# Altium schematic sheet 6_Power distribution II.schdoc
size 497 x 243 mm; Name: A_A4; Symbol: A_A4; Device: A_A4; @Project Name: TUD-EnergyHarvestingConsole_2022-08-29_17-01-09; REV: 1.0; Date: 2022-07-06; Sheet: 1/1; Draw By: Alejandro Cabrerizo; Convert to PCB: yes; Add into BOM: yes
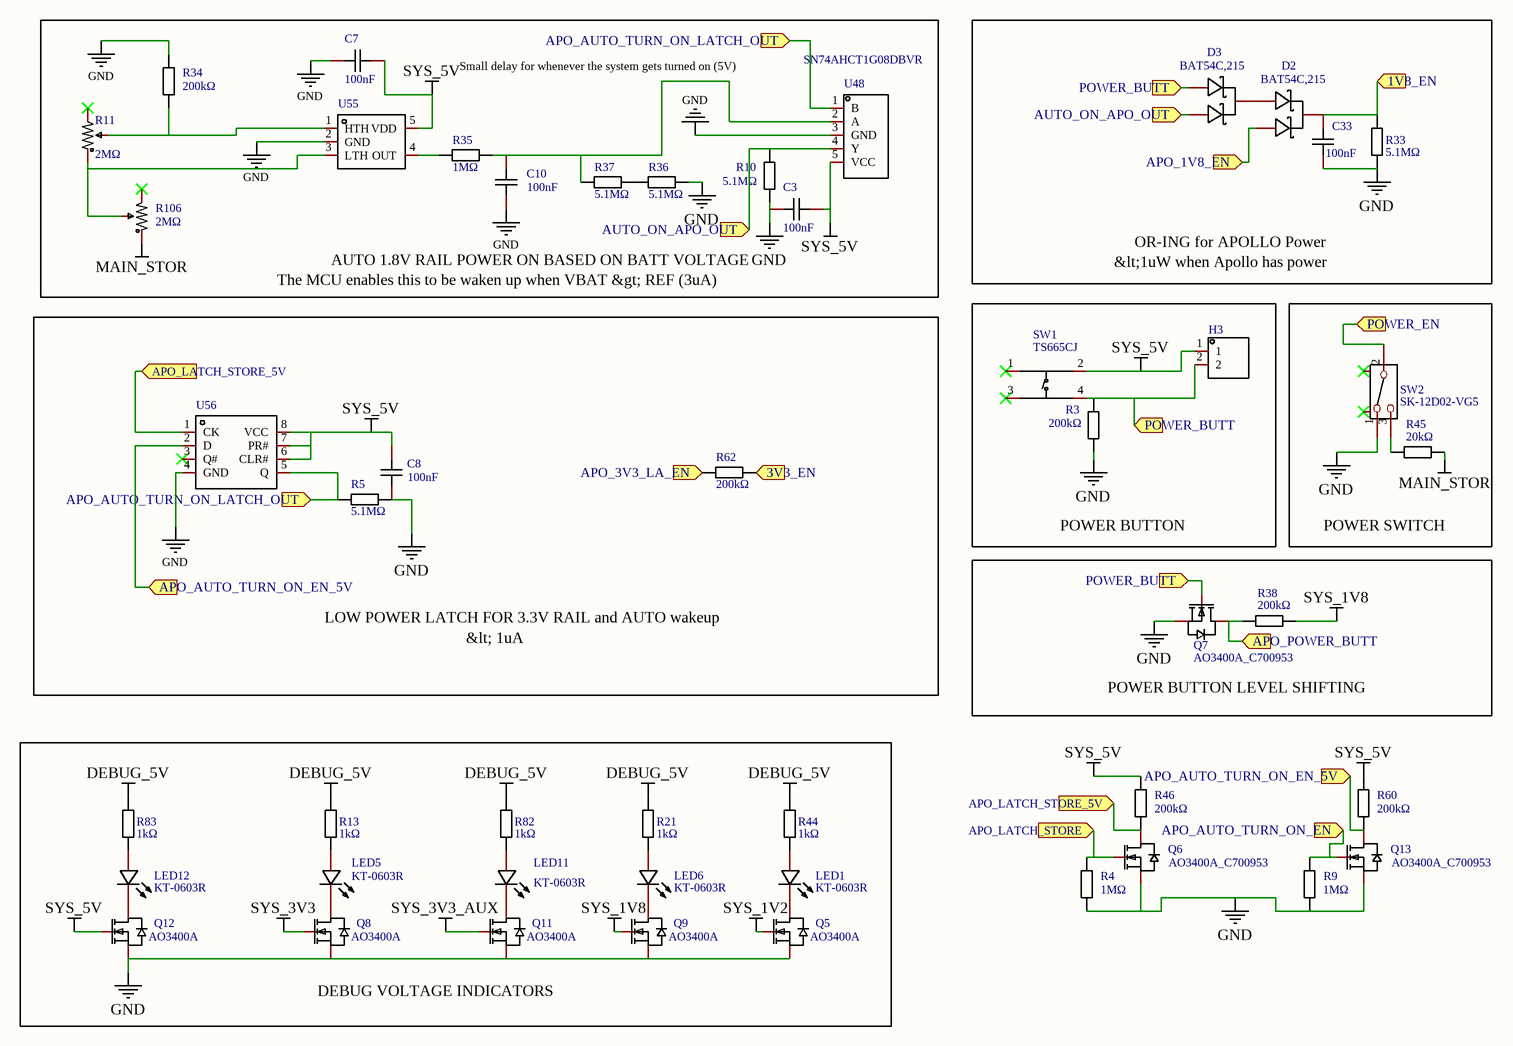
[diagram p0: 6_Power distribution II.schdoc]

## Parts
C3  100nF  [C0603]
C7  100nF  [C0603]
C8  100nF  [C0603]
C10  100nF  [C0603]
C33  100nF  [C0603]
D2  BAT54C,215  [SOT-23-3_L2.9-W1.6-P1.90-LS2.8-BR]
D3  BAT54C,215  [SOT-23-3_L2.9-W1.6-P1.90-LS2.8-BR]
H3  HDR-M_2.54_1x2P  [HDR-TH_2P-P2.54-V-M-1]  (value not drawn)
LED1  KT-0603R  [LED0603-R-RD]
LED5  KT-0603R  [LED0603-R-RD]
LED6  KT-0603R  [LED0603-R-RD]
LED11  KT-0603R  [LED0603-R-RD]
LED12  KT-0603R  [LED0603-R-RD]
Q5  AO3400A  [SOT-23-3_L2.9-W1.3-P1.90-LS2.4-BR]
Q6  AO3400A_C700953  [SOT-23-3_L2.9-W1.3-P1.90-LS2.4-BR]
Q7  AO3400A_C700953  [SOT-23-3_L2.9-W1.3-P1.90-LS2.4-BR]
Q8  AO3400A  [SOT-23-3_L2.9-W1.3-P1.90-LS2.4-BR]
Q9  AO3400A  [SOT-23-3_L2.9-W1.3-P1.90-LS2.4-BR]
Q11  AO3400A  [SOT-23-3_L2.9-W1.3-P1.90-LS2.4-BR]
Q12  AO3400A  [SOT-23-3_L2.9-W1.3-P1.90-LS2.4-BR]
Q13  AO3400A_C700953  [SOT-23-3_L2.9-W1.3-P1.90-LS2.4-BR]
R3  200kΩ  [R0603]
R4  1MΩ  [R0603]
R5  5.1MΩ  [R0603]
R9  1MΩ  [R0603]
R10  5.1MΩ  [R0603]
R11  2MΩ  [RES-ADJ-TH_3P-L9.5-W9.5-P2.54-BR-BS]
R13  1kΩ  [R0603]
R21  1kΩ  [R0603]
R33  5.1MΩ  [R0603]
R34  200kΩ  [R0603]
R35  1MΩ  [R0603]
R36  5.1MΩ  [R0603]
R37  5.1MΩ  [R0603]
R38  200kΩ  [R0603]
R44  1kΩ  [R0603]
R45  20kΩ  [R0603]
R46  200kΩ  [R0603]
R60  200kΩ  [R0603]
R62  200kΩ  [R0603]
R82  1kΩ  [R0603]
R83  1kΩ  [R0603]
R106  2MΩ  [RES-ADJ-TH_3P-L9.5-W9.5-P2.54-BR-BS]
SW1  TS665CJ  [SW-TH_4P-L6.0-W6.0-P4.50-LS6.5]
SW2  SK-12D02-VG5  [SW-TH_SK-12D02-VG5]
U48  Manufacturer Part: SN74AHCT1G08DBVR  [SOT-23-5_L3.0-W1.7-P0.95-LS2.8-BR]  (hidden comment: SN74AHCT1G08DBVR_C113521)
U55  MIC841HYC5-TR  [SC-70-5_L2.1-W1.3-P0.65-LS2.1-BL]  (value not drawn)
U56  TC7W74FU,LF  [TSSOP-8_L3.0-W3.0-P0.65-LS4.9-BR]  (value not drawn)

## Blocks framed on the sheet
POWER BUTTON: H3 R3 SW1
POWER SWITCH: R45 SW2
POWER BUTTON LEVEL SHIFTING: Q7 R38
DEBUG VOLTAGE INDICATORS: LED1 LED5 LED6 LED11 LED12 Q5 Q8 Q9 Q11 Q12 R13 R21 R44 R82 R83

## Ports
1V8_EN (in), 3V3_EN (in), APO_1V8_EN (in), APO_3V3_LA_EN (in), APO_AUTO_TURN_ON_EN (in), APO_AUTO_TURN_ON_EN_5V (in), APO_AUTO_TURN_ON_LATCH_OUT (in), APO_LATCH_STORE (in), APO_LATCH_STORE_5V (in), APO_POWER_BUTT (in), AUTO_ON_APO_OUT (in), POWER_BUTT (in), POWER_EN (in)

## Nets
DEBUG_5V: R13.2 R21.2 R44.2 R82.2 R83.2
GND: C3.1 C7.1 C8.2 C10.1 C33.2 Q5.2(S) Q6.2(S) Q7.2(S) Q8.2(S) Q9.2(S) Q11.2(S) Q12.2(S) Q13.2(S) R3.1 R4.2 R5.2 R9.2 R10.2 R33.2 R34.1 R36.2 SW2.1 U48.3(GND) U55.2(GND) U56.4(GND)
MAIN_STOR: R45.1 R106.1
SYS_1V2: Q5.1(G)
SYS_1V8: Q9.1(G) R38.1
SYS_3V3: Q8.1(G)
SYS_3V3_AUX: Q11.1(G)
SYS_5V: C3.2 C7.2 C8.1 H3.1 Q12.1(G) R46.1 R60.1 SW1.2(B) U48.5(VCC) U55.5(VDD) U56.6(CLR#) U56.7(PR#) U56.8(VCC)
1V8_EN: C33.1 D2.3(K) R33.1 ; port 1V8_EN
3V3_EN: R62.2 ; port 3V3_EN
APO_1V8_EN: D2.2(A) ; port APO_1V8_EN
APO_3V3_LA_EN: R62.1 ; port APO_3V3_LA_EN
APO_AUTO_TURN_ON_EN: Q13.1(G) R9.1 ; port APO_AUTO_TURN_ON_EN
APO_AUTO_TURN_ON_EN_5V: Q13.3(D) R60.2 U56.2(D) ; port APO_AUTO_TURN_ON_EN_5V
APO_AUTO_TURN_ON_LATCH_OUT: R5.1 U48.1(B) U56.5(Q) ; port APO_AUTO_TURN_ON_LATCH_OUT
APO_LATCH_STORE: Q6.1(G) R4.1 ; port APO_LATCH_STORE
APO_LATCH_STORE_5V: Q6.3(D) R46.2 U56.1(CK) ; port APO_LATCH_STORE_5V
APO_POWER_BUTT: Q7.3(D) R38.2 ; port APO_POWER_BUTT
AUTO_ON_APO_OUT: D3.2(A) R10.1 U48.4(Y) ; port AUTO_ON_APO_OUT
POWER_BUTT: D3.1(A) H3.2 Q7.1(G) R3.2 SW1.4(D) ; port POWER_BUTT
POWER_EN: SW2.2 ; port POWER_EN
NetC10_2: C10.2 R35.1 R37.1 U48.2(A)
NetD2_1: D2.1(A) D3.3(K)
NetLED1_1: LED1.1(A) R44.1
NetLED1_2: LED1.2(K) Q5.3(D)
NetLED5_1: LED5.1(A) R13.1
NetLED5_2: LED5.2(K) Q8.3(D)
NetLED6_1: LED6.1(A) R21.1
NetLED6_2: LED6.2(K) Q9.3(D)
NetLED11_1: LED11.1(A) R82.1
NetLED11_2: LED11.2(K) Q11.3(D)
NetLED12_1: LED12.1(A) R83.1
NetLED12_2: LED12.2(K) Q12.3(D)
NetR11_1: R11.1 R106.2 U55.3(LTH)
NetR11_2: R11.2 R34.2 U55.1(HTH)
NetR35_2: R35.2 U55.4(OUT)
NetR36_1: R36.1 R37.2
NetR45_2: R45.2 SW2.3

Not connected (* = marked no-connect by the designer): R11 3*; R106 3*; SW1 1(A)* 3(C)*; SW2 4* 5*; U56 3(Q#)*

## Notes on the sheet
- Small delay for whenever the system gets turned on (5V)
- OR-ING for APOLLO Power
- The MCU enables this to be waken up when VBAT &gt; REF (3uA)
- AUTO 1.8V RAIL POWER ON BASED ON BATT VOLTAGE
- &lt;1uW when Apollo has power
- LOW POWER LATCH FOR 3.3V RAIL and AUTO wakeup
- &lt; 1uA
- 1
- 2
- 3
- 4
- 5
- A
- B
- C
- D
- TITLE:
- TUD-EnergyHarvestingConsole_2022-08-29_17-01-09
- REV:
- 1.0
- Date:
- Company:
- 2022-07-06
- Drawn By:
- Alejandro Cabrerizo
- Sheet:
- 1/1

## Library data of the parts
C3 C7 C8 C10 C33 = CC0603KRX7R9BB104: Manufacturer: YAGEO; Convert to PCB: yes; Name: 100nF; Symbol: 100nF; Device: CC0603KRX7R9BB104; Supplier: LCSC; Manufacturer Part: CC0603KRX7R9BB104; Supplier Part: C14663; JLCPCB Part Class: Basic; Add into BOM: yes; Origin Footprint: C0603
D2 D3 = BAT54C,215: Manufacturer: Nexperia; Convert to PCB: yes; Name: BAT54C,215; Symbol: BAT54C,215; Device: BAT54C,215; Supplier: LCSC; Manufacturer Part: BAT54C,215; Supplier Part: C37704; JLCPCB Part Class: Basic Part; Add into BOM: yes; Origin Footprint: SOT-23-3_L2.9-W1.6-P1.90-LS2.8-BR
H3 = HDR-M_2.54_1x2P: Symbol: 210S-1*2P L=11.6MMGold-plated black; Convert to PCB: yes; Device: HDR-M_2.54_1x2P; Add into BOM: yes; Supplier Footprint: Through
LED1 LED5 LED6 LED11 LED12 = KT-0603R: Manufacturer: KENTO; Convert to PCB: yes; Name: KT-0603R; Symbol: KT-0603R; Device: KT-0603R; Supplier: LCSC; Manufacturer Part: KT-0603R; Supplier Part: C2286; JLCPCB Part Class: Basic Part; Add into BOM: yes; Origin Footprint: LED0603-R-RD
Q5 Q9 Q11 = AO3400A: Manufacturer: HUASHUO(华朔); Convert to PCB: yes; NUMBER: 3; Name: AO3400A; Symbol: AO3400A; Device: AO3400A; Supplier: LCSC; Supplier Part: C700953; Manufacturer Part: AO3400A; JLCPCB Part Class: Extended Part; Add into BOM: yes; Origin Footprint: SOT-23-3_L2.9-W1.3-P1.90-LS2.4-BR
Q6-Q8 Q12 Q13 = AO3400A: Manufacturer: HUASHUO(华朔); Convert to PCB: yes; Symbol: AO3400A; Device: AO3400A; Supplier: LCSC; Supplier Part: C700953; Manufacturer Part: AO3400A; JLCPCB Part Class: Extended Part; Add into BOM: yes; Origin Footprint: SOT-23-3_L2.9-W1.3-P1.90-LS2.4-BR
  Q6 Q7 Q13: Name: AO3400A_C700953
  Q8 Q12: Name: AO3400A
R3 R34 R38 R46 R60 R62 = 0603WAF2003T5E: Manufacturer: UniOhm; Resistance: 200K; Convert to PCB: yes; Name: 200kΩ; Symbol: 200kΩ; Device: 0603WAF2003T5E; Supplier: LCSC; Manufacturer Part: 0603WAF2003T5E; Supplier Part: C25811; JLCPCB Part Class: Basic Part; Add into BOM: yes; Origin Footprint: R0603
R4 R9 = 0603WAF1004T5E: Manufacturer: UniOhm; Resistance: 1M; Convert to PCB: yes; NUMBER: 2; Name: 1MΩ; Symbol: 1MΩ; Device: 0603WAF1004T5E; Supplier: LCSC; Manufacturer Part: 0603WAF1004T5E; Supplier Part: C22935; JLCPCB Part Class: Basic Part; Add into BOM: yes; Origin Footprint: R0603
R5 = 0603WAF5104T5E: Manufacturer: UniOhm; Resistance: 5.1M; Convert to PCB: yes; NAME: 1; Name: 5.1MΩ; Symbol: 5.1MΩ; Device: 0603WAF5104T5E; Supplier: LCSC; Manufacturer Part: 0603WAF5104T5E; Supplier Part: C13320; JLCPCB Part Class: Basic Part; Add into BOM: yes; Origin Footprint: R0603; NUMBER: 1
R10 R33 R36 R37 = 0603WAF5104T5E: Manufacturer: UniOhm; Resistance: 5.1M; Convert to PCB: yes; Name: 5.1MΩ; Symbol: 5.1MΩ; Device: 0603WAF5104T5E; Supplier: LCSC; Manufacturer Part: 0603WAF5104T5E; Supplier Part: C13320; JLCPCB Part Class: Basic Part; Add into BOM: yes; Origin Footprint: R0603
R11 R106 = 3386P-1-205LF: Resistance: Tolerance:±10% Tolerance:±10%; Manufacturer: BOURNS; Add into BOM: yes; Tolerance: ±10%; Name: 2MΩ; Symbol: 3386P-1-205LF; Device: 3386P-1-205LF; LCSC Part Name: 2MΩ ±10%; Supplier Part: C116289; Manufacturer Part: 3386P-1-205LF; Supplier Footprint: 插件; JLCPCB Part Class: Extended Part; Datasheet: https://atta.szlcsc.com/upload/public/pdf/source/20170630/1498816655617.pdf; Supplier: LCSC; Convert to PCB: yes; Value: 2MΩ
R13 R21 R44 R82 R83 = 0603WAF1001T5E: Manufacturer: UniOhm; Resistance: 1K; Convert to PCB: yes; Name: 1kΩ; Symbol: 1kΩ; Device: 0603WAF1001T5E; Supplier: LCSC; Manufacturer Part: 0603WAF1001T5E; Supplier Part: C21190; JLCPCB Part Class: Basic Part; Add into BOM: yes; Origin Footprint: R0603
R35 = 0603WAF1004T5E: Manufacturer: UniOhm; Resistance: 1M; Convert to PCB: yes; Name: 1MΩ; Symbol: 1MΩ; Device: 0603WAF1004T5E; Supplier: LCSC; Manufacturer Part: 0603WAF1004T5E; Supplier Part: C22935; JLCPCB Part Class: Basic Part; Add into BOM: yes; Origin Footprint: R0603
R45 = 0603WAF2002T5E: Manufacturer: UniOhm; Resistance: 20K; Convert to PCB: yes; Name: 20kΩ; Symbol: 20kΩ; Device: 0603WAF2002T5E; Supplier: LCSC; Manufacturer Part: 0603WAF2002T5E; Supplier Part: C4184; JLCPCB Part Class: Basic Part; Add into BOM: yes; Origin Footprint: R0603
SW1 = TS665CJ: Manufacturer: SHOU HAN; Convert to PCB: yes; Name: TS665CJ; Symbol: TS665CJ; Device: TS665CJ; Supplier: LCSC; Supplier Part: C393938; Manufacturer Part: TS665CJ; JLCPCB Part Class: Extended Part; Add into BOM: yes; Origin Footprint: SW-TH_4P-L6.0-W6.0-P4.50-LS6.5
SW2 = SK-12D02-VG5: Manufacturer: Rectangular Connectors - Contacts; Convert to PCB: yes; Name: SK-12D02-VG5; Symbol: SK-12D02-VG5; Device: SK-12D02-VG5; Supplier: LCSC; Supplier Part: C136722; Manufacturer Part: SK-12D02-VG5; JLCPCB Part Class: Extended Part; Add into BOM: yes; Origin Footprint: SW-TH_SK-12D02-VG5
U48 = SN74AHCT1G08DBVR_C113521: Series: Logic Type:And number of channels:1 Number of inputs per channel:2 Supply Voltage(Single):4.5V~5.5V Supply Voltage(Single):4.5V~5.5V Quiescent Current (Max):1uA Max Propagation Delay @ V, Max CL:7.9ns@5V,50pF Low Level Output Current:8mA Hight Lev; Manufacturer: TI(德州仪器); Add into BOM: yes; Logic Type: And; number of channels: 1; Number of inputs per channel: 2; Quiescent Current (Max): 1uA; Low Level Output Current: 8mA; Logical Level - High: 2V; Logical Level - low: 0.8V; Name: SN74AHCT1G08DBVR; Symbol: SN74AHCT1G08DBVR; Device: SN74AHCT1G08DBVR_C113521; LCSC Part Name: 与门; Supplier Part: C113521; Supplier Footprint: SOT-23-5; JLCPCB Part Class: Extended Part; Datasheet: https://atta.szlcsc.com/upload/public/pdf/source/20170606/1496716423549.pdf; Supplier: LCSC; Convert to PCB: yes; Supply Voltage(Single): 4.5V~5.5V; Max Propagation Delay @ V, Max CL: 7.9ns@5V,50pF; Hight Level Output Current: 8mA; Operating Temperature: -40℃~+125℃
U55 = MIC841HYC5-TR: Number of Elements:- Supply Voltage（Single）: Iq per channel (Typ): Output Type: Propagation Delay (Max): Operating Temperature:; Manufacturer: MICROCHIP(美国微芯); Add into BOM: yes; Name: MIC841HYC5-TR; Symbol: MIC841HYC5-TR; Device: MIC841HYC5-TR; LCSC Part Name: MIC841HYC5-TR; Supplier Part: C511290; Manufacturer Part: MIC841HYC5-TR; Supplier Footprint: SC-70-5; JLCPCB Part Class: Extended Part; Datasheet: https://atta.szlcsc.com/upload/public/pdf/source/20200408/C511290_C3E13C53EE3A670E619F6E9726D1A630.pdf; Supplier: LCSC; Convert to PCB: yes; Number of Elements: -
U56 = TC7W74FU,LF: Series:TC7W Function:设置和复位 Type:D-Type Output Type:Differential Clock Frequency:67MHz Max Propagation Delay @ V, Max CL:26ns@6V,50pF Trigger Type:PositiveEdge Voltage - Supply:2V~6V Voltage - Supply:2V~6V Quiescent Current (Iq):2uA Input Capacitance:5pF C; Manufacturer: TOSHIBA(东芝); Add into BOM: yes; Function: 设置和复位; Clock Frequency: 67MHz; Voltage - Supply: 2V~6V; Quiescent Current (Iq): 2uA; Input Capacitance: 5pF; Current-OutputLow: 5.2mA; Name: TC7W74FU,LF; Symbol: TC7W74FU,LF; Device: TC7W74FU,LF; LCSC Part Name: TC7W74FU,LF; Supplier Part: C128631; Manufacturer Part: TC7W74FU,LF; Supplier Footprint: TSSOP-8(3x3x0.65); JLCPCB Part Class: Extended Part; Datasheet: https://atta.szlcsc.com/upload/public/pdf/source/20170914/C128631_1505359838365968002.pdf; Supplier: LCSC; Convert to PCB: yes; Series: TC7W; Type: D-Type; Output Type: Differential; Max Propagation Delay @ V, Max CL: 26ns@6V,50pF; Trigger Type: PositiveEdge; Current-OutputHigh: 5.2mA